# Altium schematic sheet ECAL-TEST-MICRO-D.SchDoc
size A; SheetNumber: 5; SheetTotal: 5
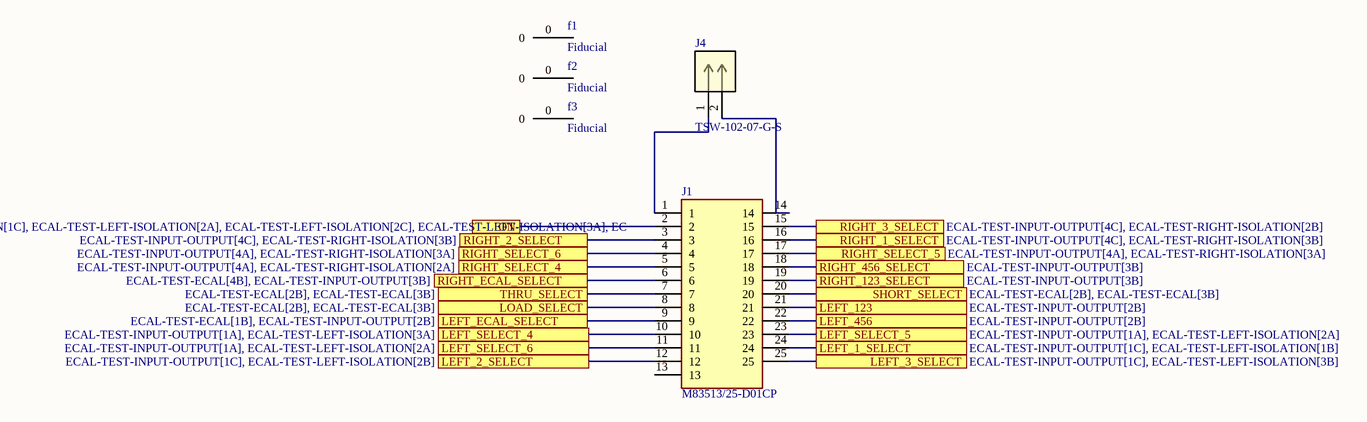
[diagram p0: ECAL-TEST-MICRO-D.SchDoc]

## Parts
f1  Fiducial  [fiducial]
f2  Fiducial  [fiducial]
f3  Fiducial  [fiducial]
J1  M83513/25-D01CP  [BEL_M83513/25-D01CP]
J4  TSW-102-07-G-S  [CON2_1X2_TU_TSW]

## Ports
LEFT_1_SELECT (see ECAL-TEST-INPUT-OUTPUT[1C], ECAL-TEST-LEFT-ISOLATION[1B]), LEFT_2_SELECT (see ECAL-TEST-INPUT-OUTPUT[1C], ECAL-TEST-LEFT-ISOLATION[2B]), LEFT_3_SELECT (see ECAL-TEST-INPUT-OUTPUT[1C], ECAL-TEST-LEFT-ISOLATION[3B]), LEFT_123 (see ECAL-TEST-INPUT-OUTPUT[2B]), LEFT_456 (see ECAL-TEST-INPUT-OUTPUT[2B]), LEFT_ECAL_SELECT (see ECAL-TEST-ECAL[1B], ECAL-TEST-INPUT-OUTPUT[2B]), LEFT_SELECT_4 (see ECAL-TEST-INPUT-OUTPUT[1A], ECAL-TEST-LEFT-ISOLATION[3A]), LEFT_SELECT_5 (see ECAL-TEST-INPUT-OUTPUT[1A], ECAL-TEST-LEFT-ISOLATION[2A]), LEFT_SELECT_6 (see ECAL-TEST-INPUT-OUTPUT[1A], ECAL-TEST-LEFT-ISOLATION[2A]), LOAD_SELECT (see ECAL-TEST-ECAL[2B], ECAL-TEST-ECAL[3B]), ON (see ECAL-TEST-ECAL[1B], ECAL-TEST-ECAL[2B], ECAL-TEST-ECAL[3B], ECAL-TEST-ECAL[4B], ECAL-TEST-INPUT-OUTPUT[1A], ECAL-TEST-INPUT-OUTPUT[1C], ECAL-TEST-INPUT-OUTPUT[2B], ECAL-TEST-INPUT-OUTPUT[3B], ECAL-TEST-INPUT-OUTPUT[4A], ECAL-TEST-INPUT-OUTPUT[4C], ECAL-TEST-LEFT-ISOLATION[1A], ECAL-TEST-LEFT-ISOLATION[1C], ECAL-TEST-LEFT-ISOLATION[2A], ECAL-TEST-LEFT-ISOLATION[2C], ECAL-TEST-LEFT-ISOLATION[3A], ECAL-TEST-LEFT-ISOLATION[3C], ECAL-TEST-RIGHT-ISOLATION[2A], ECAL-TEST-RIGHT-ISOLATION[2C], ECAL-TEST-RIGHT-ISOLATION[3A], ECAL-TEST-RIGHT-ISOLATION[3C]), RIGHT_1_SELECT (see ECAL-TEST-INPUT-OUTPUT[4C], ECAL-TEST-RIGHT-ISOLATION[3B]), RIGHT_2_SELECT (see ECAL-TEST-INPUT-OUTPUT[4C], ECAL-TEST-RIGHT-ISOLATION[3B]), RIGHT_3_SELECT (see ECAL-TEST-INPUT-OUTPUT[4C], ECAL-TEST-RIGHT-ISOLATION[2B]), RIGHT_123_SELECT (see ECAL-TEST-INPUT-OUTPUT[3B]), RIGHT_456_SELECT (see ECAL-TEST-INPUT-OUTPUT[3B]), RIGHT_ECAL_SELECT (see ECAL-TEST-ECAL[4B], ECAL-TEST-INPUT-OUTPUT[3B]), RIGHT_SELECT_4 (see ECAL-TEST-INPUT-OUTPUT[4A], ECAL-TEST-RIGHT-ISOLATION[2A]), RIGHT_SELECT_5 (see ECAL-TEST-INPUT-OUTPUT[4A], ECAL-TEST-RIGHT-ISOLATION[3A]), RIGHT_SELECT_6 (see ECAL-TEST-INPUT-OUTPUT[4A], ECAL-TEST-RIGHT-ISOLATION[3A]), SHORT_SELECT (see ECAL-TEST-ECAL[2B], ECAL-TEST-ECAL[3B]), THRU_SELECT (see ECAL-TEST-ECAL[2B], ECAL-TEST-ECAL[3B])

## Nets
LEFT_1_SELECT: J1.24 ; port LEFT_1_SELECT
LEFT_2_SELECT: J1.12 ; port LEFT_2_SELECT
LEFT_3_SELECT: J1.25 ; port LEFT_3_SELECT
LEFT_123: J1.21 ; port LEFT_123
LEFT_456: J1.22 ; port LEFT_456
LEFT_ECAL_SELECT: J1.9 ; port LEFT_ECAL_SELECT
LEFT_SELECT_4: J1.10 ; port LEFT_SELECT_4
LEFT_SELECT_5: J1.23 ; port LEFT_SELECT_5
LEFT_SELECT_6: J1.11 ; port LEFT_SELECT_6
LOAD_SELECT: J1.8 ; port LOAD_SELECT
ON: J1.2 ; port ON
RIGHT_1_SELECT: J1.16 ; port RIGHT_1_SELECT
RIGHT_2_SELECT: J1.3 ; port RIGHT_2_SELECT
RIGHT_3_SELECT: J1.15 ; port RIGHT_3_SELECT
RIGHT_123_SELECT: J1.19 ; port RIGHT_123_SELECT
RIGHT_456_SELECT: J1.18 ; port RIGHT_456_SELECT
RIGHT_ECAL_SELECT: J1.6 ; port RIGHT_ECAL_SELECT
RIGHT_SELECT_4: J1.5 ; port RIGHT_SELECT_4
RIGHT_SELECT_5: J1.17 ; port RIGHT_SELECT_5
RIGHT_SELECT_6: J1.4 ; port RIGHT_SELECT_6
SHORT_SELECT: J1.20 ; port SHORT_SELECT
THRU_SELECT: J1.7 ; port THRU_SELECT
NetJ1_1: J1.1 J4.1
NetJ1_14: J1.14 J4.2

Not connected (* = marked no-connect by the designer): f1 0; f2 0; f3 0; J1 13

## Library data of the parts
J1 = M83513/25-D01CP: MIL-DTL-83513 PCB Mounted Connector | Socket | 25 Positions | Shell Finish - Cadmium | Female | PCB Solder Pins | 0.109" (2.77 mm) Pin Length; Package: None; Price: None; Value: *; MP: M83513/25-D01CP; Availability: Unavailable
J4 = TSW-102-07-G-S: No Description Available; Mfr_Name: Samtec Inc; Copyright: Copyright (C) 2024 Ultra Librarian. All rights reserved.; Manufacturer_Part_Number: TSW-102-07-G-S; RefDes: RefDes; Type: DEV